# EAGLE design panocama (EAGLE 9.6.2)
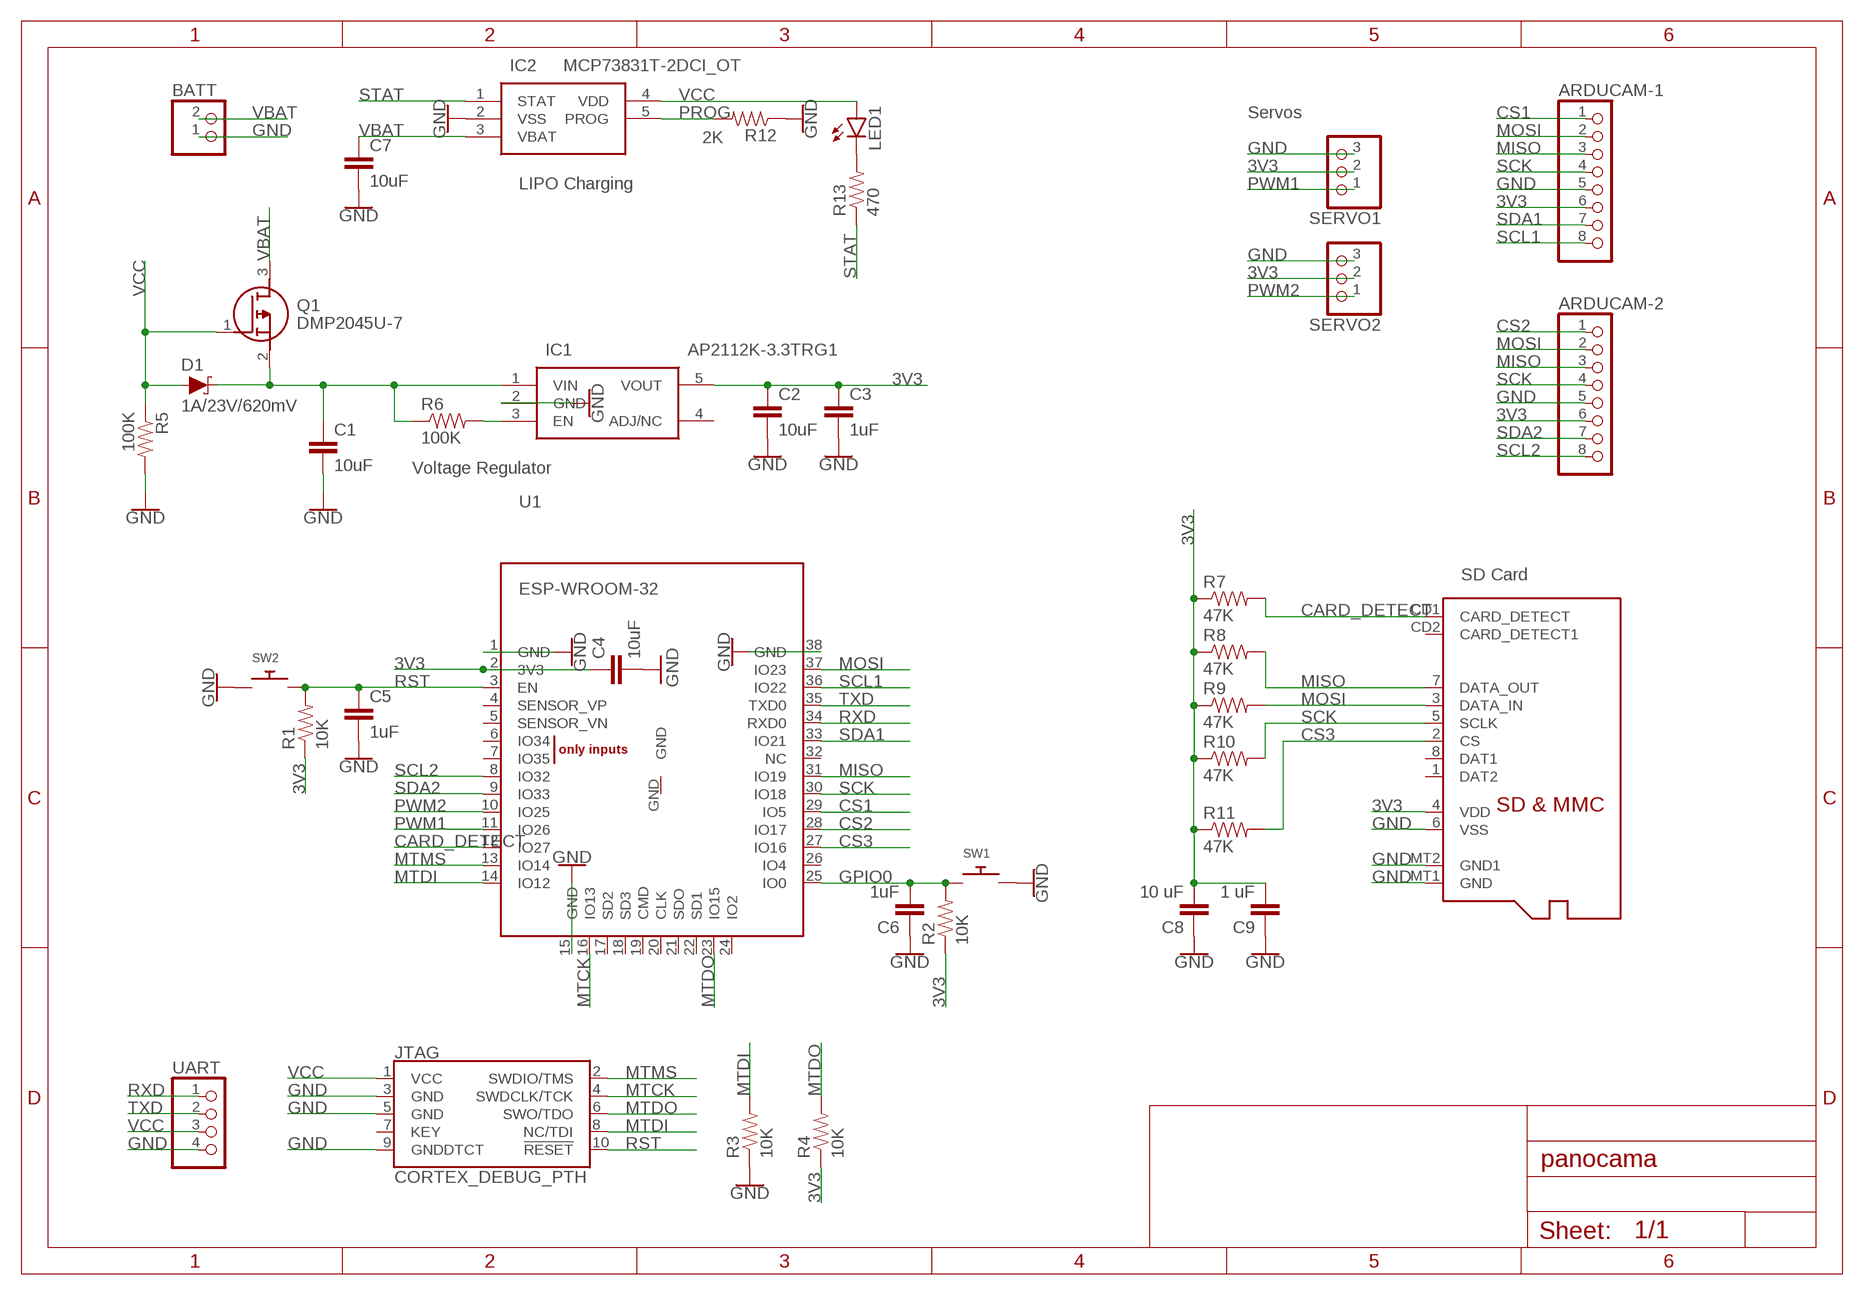
[diagram p0: schematic, sheet 1]

## Parts
ARDUCAM-1  PINHD-1X8CLEANBIG  [1X08-CLEANBIG]
ARDUCAM-2  PINHD-1X8CLEANBIG  [1X08-CLEANBIG]
BATT  JST_2PIN-SMT  [JST-PH-2-SMT]
C1  10uF  CAP  [0805]
C2  10uF  CAP  [0805]
C3  1uF  CAP  [0805]
C4  10uF  CAP  [0805]
C5  1uF  CAP  [0805]
C6  1uF  CAP  [0805]
C7  10uF  CAP  [0805]
C8  10 uF  CAP  [0805]
C9  1 uF  CAP  [0805]
D1  1A/23V/620mV  DIODE-SCHOTTKY-BAT20J  [SOD-323]
IC1  AP2112K-3.3TRG1  [SOT95P282X130-5N]
IC2  MCP73831T-2DCI_OT  [SOT95P270X145-5N]
JTAG  CORTEX_DEBUG_PTH  [2X5-PTH-1.27MM]
LED1  LED0603  [LED-0603]
Q1  DMP2045U-7  [SOT96P240X110-3N]
R1  10K  RES  [0805]
R2  10K  RES  [0805]
R3  10K  RES  [0805]
R4  10K  RES  [0805]
R5  100K  RES  [0805]
R6  100K  RES  [0805]
R7  47K  RES  [0805]
R8  47K  RES  [0805]
R9  47K  RES  [0805]
R10  47K  RES  [0805]
R11  47K  RES  [0805]
R12  2K  RES  [0805]
R13  470  RES  [0805]
SD  MICROSD  [MICROSD]
SERVO1  PINHD-1X3  [1X03]
SERVO2  PINHD-1X3  [1X03]
SW1  SWITCH_PUSHBUTTONSOFTTOUCHSMD_SJ  [PUSHBUTTON_SMD_SJ]
SW2  SWITCH_PUSHBUTTONSOFTTOUCHSMD_SJ  [PUSHBUTTON_SMD_SJ]
U1  ESP-WROOM-32  [ESP-WROOM-32]
UART  PINHD-1X4  [1X04]

## Nets
3V3: ARDUCAM-1.6 ARDUCAM-2.6 C2.1 C3.1 C4.1 C8.2 C9.2 IC1.5(VOUT) R1.1 R2.1 R4.1 R7.1 R8.1 R9.1 R10.1 R11.1 SD.4(VDD) SERVO1.2 SERVO2.2 U1.2(3V3)
CARD_DETECT: R7.2 SD.CD1(CARD_DETECT) U1.12(IO27)
CS1: ARDUCAM-1.1 U1.29(IO5)
CS2: ARDUCAM-2.1 U1.28(IO17)
CS3: R11.2 SD.2(CS) U1.27(IO16)
GND: ARDUCAM-1.5 ARDUCAM-2.5 BATT.1 C1.2 C2.2 C3.2 C4.2 C5.2 C6.1 C7.2 C8.1 C9.1 IC1.2(GND) IC2.2(VSS) JTAG.3(GND) JTAG.5(GND) JTAG.9(GNDDTCT) R3.1 R5.2 R12.1 SD.6(VSS) SD.MT1(GND) SD.MT2(GND1) SERVO1.3 SERVO2.3 SW1.P$2 SW2.P$1 U1.1(GND) U1.15(GND) U1.38(GND) UART.4
GPIO0: C6.2 R2.2 SW1.P$1 U1.25(IO0)
MISO: ARDUCAM-1.3 ARDUCAM-2.3 R8.2 SD.7(DATA_OUT) U1.31(IO19)
MOSI: ARDUCAM-1.2 ARDUCAM-2.2 R9.2 SD.3(DATA_IN) U1.37(IO23)
MTCK: JTAG.4(SWDCLK/TCK) U1.16(IO13)
MTDI: JTAG.8(NC/TDI) R3.2 U1.14(IO12)
MTDO: JTAG.6(SWO/TDO) R4.2 U1.23(IO15)
MTMS: JTAG.2(SWDIO/TMS) U1.13(IO14)
N$1: IC1.3(EN) R6.2
N$2: C1.1 D1.C IC1.1(VIN) Q1.2(S) R6.1
N$4: LED1.C R13.2
PROG: IC2.5(PROG) R12.2
PWM1: SERVO1.1 U1.11(IO26)
PWM2: SERVO2.1 U1.10(IO25)
RST: C5.1 JTAG.10(!RESET) R1.2 SW2.P$2 U1.3(EN)
RXD: U1.34(RXD0) UART.1
SCK: ARDUCAM-1.4 ARDUCAM-2.4 R10.2 SD.5(SCLK) U1.30(IO18)
SCL1: ARDUCAM-1.8 U1.36(IO22)
SCL2: ARDUCAM-2.8 U1.8(IO32)
SDA1: ARDUCAM-1.7 U1.33(IO21)
SDA2: ARDUCAM-2.7 U1.9(IO33)
STAT: IC2.1(STAT) R13.1
TXD: U1.35(TXD0) UART.2
VBAT: BATT.2 C7.1 IC2.3(VBAT) Q1.3(D)
VCC: D1.A IC2.4(VDD) JTAG.1(VCC) LED1.A Q1.1(G) R5.1 UART.3
Unconnected: IC1.4(ADJ/NC) JTAG.7(KEY) SD.1(DAT2) SD.8(DAT1) SD.CD2(CARD_DETECT1) U1.4(SENSOR_VP) U1.5(SENSOR_VN) U1.6(IO34) U1.7(IO35) U1.17(SD2) U1.18(SD3) U1.19(CMD) U1.20(CLK) U1.21(SDO) U1.22(SD1) U1.24(IO2) U1.26(IO4) U1.32(NC) U1.GND

## Notes on the sheet
- Servos
- LIPO Charging
- Voltage Regulator
- SD Card

## Library data of the parts
ARDUCAM-1 ARDUCAM-2 = adafruit:PINHD-1X8: PIN HEADER
BATT = adafruit:JST_2PIN: JST 2-Pin Connectors of various flavors SMT-RA (S2B-PH-SM4) 4UConnector #17311 SMT (B2B-PH-SM4) THM-RA (S2B-PH) THM (B2B-PH)
C1-C9 = Ilya_Teach:CAP
D1 = SparkFun-DiscreteSemi:DIODE-SCHOTTKY: Schottky diode A Schottky diode is a semiconductor diode which has a low forward voltage drop and a very fast switching action.; PROD_ID: DIO-11623
IC1 = AP2112K-3.3TRG1:AP2112K-3.3TRG1: 600mA 3.3V LDO Regulator Enable SOT23-5 DiodesZetex AP2112K-3.3TRG1, LDO Voltage Regulator, 3.3 V +/-1.5%, 2.5 6 Vin, 5-Pin SOT-23 Source: Datasheet <http://uk.rs-online.com/web/p/products/8283509>; ARROW_PART_NUMBER: AP2112K-3.3TRG1; ARROW_PRICE-STOCK: https://www.arrow.com/en/products/ap2112k-3.3trg1/diodes-incorporated; DESCRIPTION: 600mA 3.3V LDO Regulator Enable SOT23-5 DiodesZetex AP2112K-3.3TRG1, LDO Voltage Regulator, 3.3 V +/-1.5%, 2.5 6 Vin, 5-Pin SOT-23; HEIGHT: 1.3mm; MANUFACTURER_NAME: Diodes Inc.; MANUFACTURER_PART_NUMBER: AP2112K-3.3TRG1; MOUSER_PART_NUMBER: 621-AP2112K-3.3TRG1; MOUSER_PRICE-STOCK: https://www.mouser.co.uk/ProductDetail/Diodes-Incorporated/AP2112K-33TRG1?qs=x6A8l6qLYDDPYHosCdzh%2FA%3D%3D
IC2 = MCP73831T-2DCI_OT:MCP73831T-2DCI_OT: Charge Controller Li-Ion/Li-Pol Source: Datasheet <http://ww1.microchip.com/downloads/en/DeviceDoc/20001984g.pdf>; ARROW_PART_NUMBER: MCP73831T-2DCI/OT; ARROW_PRICE-STOCK: https://www.arrow.com/en/products/mcp73831t-2dciot/microchip-technology; DESCRIPTION: Charge Controller Li-Ion/Li-Pol; HEIGHT: 1.45mm; MANUFACTURER_NAME: Microchip; MANUFACTURER_PART_NUMBER: MCP73831T-2DCI/OT; MOUSER_PART_NUMBER: 579-MCP73831T-2DCIOT; MOUSER_PRICE-STOCK: https://www.mouser.co.uk/ProductDetail/Microchip-Technology/MCP73831T-2DCI-OT?qs=yUQqVecv4qu38ml9qkvsJw%3D%3D
JTAG = SparkFun-Connectors:CORTEX_DEBUG: Cortex Debug Connector - 10 pin Supports JTAG debug, Serial Wire debug, and Serial Wire Viewer. PTH and SMD connector options available. General Connector Information <http://infocenter.arm.com/help/topic/com.arm.doc.faqs/attached/13634/cortex_debug_connectors.pdf> Products: PTH Connector <http://www.digikey.com/product-detail/en/cnc-tech/3220-10-0100-00/1175-1627-ND/3883661> -via Digi-Key SparkFun PSoc <https://www.sparkfun.com/products/13229> SparkFun T <https://www.sparkfun.com/products/13810>
LED1 = Ilya_Teach:LED: LEDs Standard schematic elements and footprints for 5mm, 3mm, 1206, and 0603 sized LEDs. 5mm - Spark Fun Electronics SKU : COM-00529 (and others)
Q1 = DMP2045U-7:DMP2045U-7: DMP2045U-7 P-Channel MOSFET, 3.5 (State) A, 4.3 (Steady) A, 20 V, 3-Pin SOT-23 Diodes Inc Source: Datasheet <https://www.diodes.com/assets/Datasheets/DMP2045U.pdf>; ARROW_PART_NUMBER: DMP2045U-7; ARROW_PRICE-STOCK: https://www.arrow.com/en/products/dmp2045u-7/diodes-incorporated; DESCRIPTION: DMP2045U-7 P-Channel MOSFET, 3.5 (State) A, 4.3 (Steady) A, 20 V, 3-Pin SOT-23 Diodes Inc; HEIGHT: 1.1mm; MANUFACTURER_NAME: Diodes Inc.; MANUFACTURER_PART_NUMBER: DMP2045U-7; MOUSER_PART_NUMBER: 621-DMP2045U-7; MOUSER_PRICE-STOCK: https://www.mouser.co.uk/ProductDetail/Diodes-Incorporated/DMP2045U-7?qs=rrS6PyfT74erdUwo5CgHTg%3D%3D
R1-R13 = Ilya_Teach:RES
SD = adafruit:MICROSD: Micro-SD / Transflash card holder with SPI pinout For the 3M # 2908-05WB-MG and/or 4UCON #19656 push-push type
SERVO1 SERVO2 = adafruit:PINHD-1X3: PIN HEADER
SW1 SW2 = adafruit:SWITCH_PUSHBUTTON: Buttons SOFTTOUCHSMD_SJ - Soft touch temporary push button (Super Junk Akihabara) Compatible with SKPMANE010 [Mouser: 688-SKPMAN] C&K_KSS = Digikey: KSS221GLFS
U1 = esp32:ESP-WROOM-32
UART = pinhead:PINHD-1X4: PIN HEADER

## Board
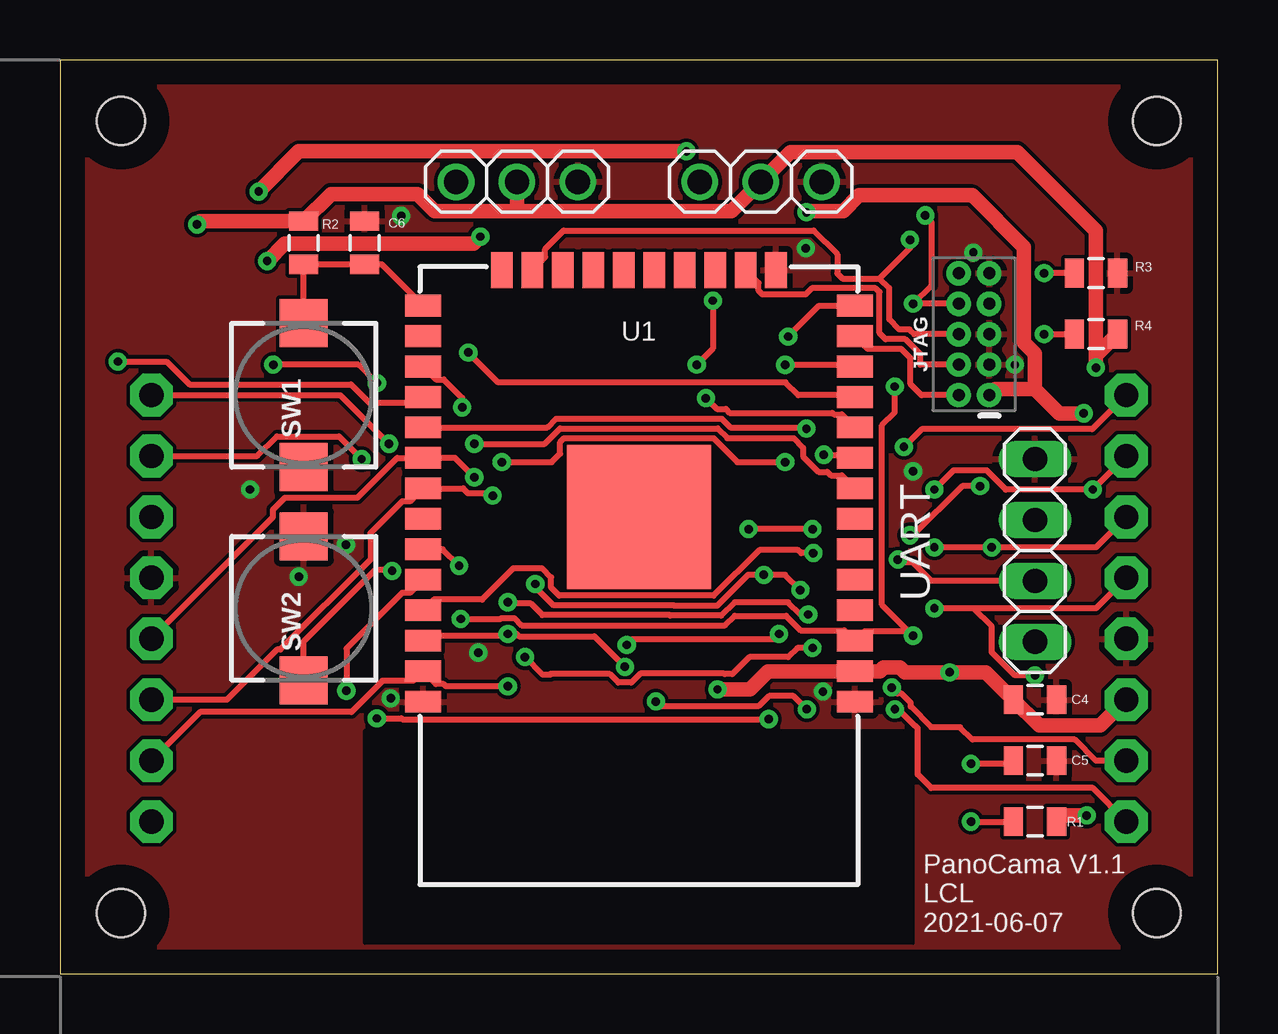
[diagram p1: board, top side]
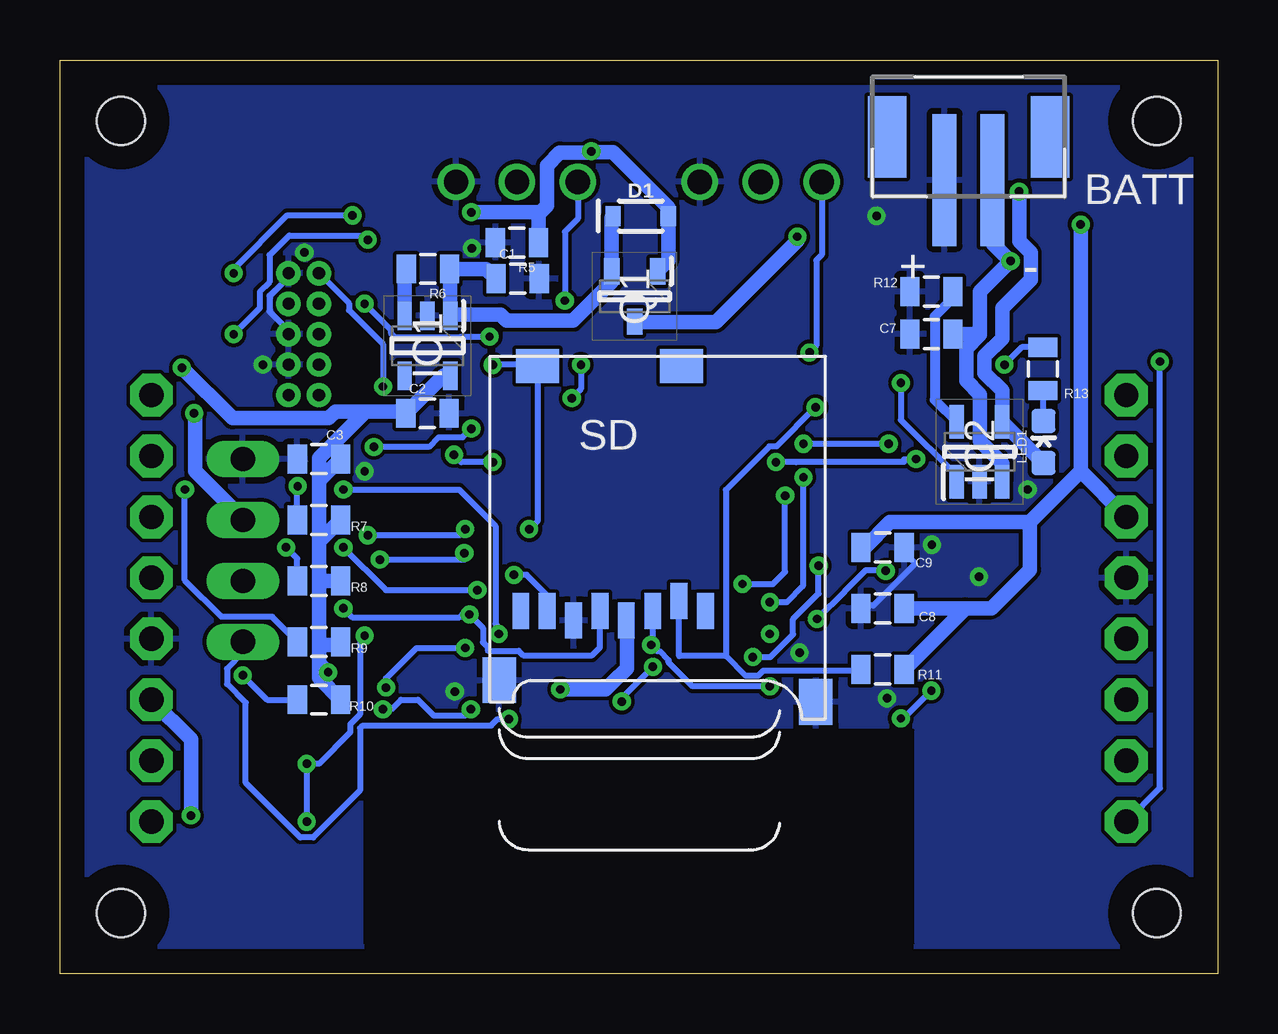
[diagram p2: board, bottom side, seen from below]

Size 48.26 x 38.1 mm. Coordinates in mm from the lower left corner, seen from the top.
Outline: 0,0 48.26,0 48.26,38.1 0,38.1 0,0
Copper layers (1*16): Top 0.035mm / dielectric 1.5mm / Bottom 0.035mm
Design rules "default": minimum track width 6mil, minimum drill 0.35mm, track to track 6mil, track to pad 6mil, pad to pad 6mil, via to via 6mil, smd to smd 6mil, copper to edge 40mil, drill to drill 6mil, minimum pad ring 10mil, minimum via ring 8mil, stop-mask expansion 4mil, vias tented up to drill 0mil, thermal gap 10mil
Holes 2 mm at 2.54,2.54 45.72,2.54 45.72,35.56 2.54,35.56

### Footprints (pad centres in the part's own frame; a part is rotated, then mirrored left to right if it is on the bottom)
1X08-CLEANBIG = drill 1.016 pad 1.778 octagon: 1 -8.89,0; 2 -6.35,0; 3 -3.81,0; 4 -1.27,0; 5 1.27,0; 6 3.81,0; 7 6.35,0; 8 8.89,0
JST-PH-2-SMT = smd 1 x 5.5: 1 -1,-1.8; 2 1,-1.8 | smd 1.6 x 3.4: NC1 -3.4,0; NC2 3.4,0
0805 = smd 0.8 x 1.2: 1 -0.9,0; 2 0.9,0
SOD-323 = smd 0.63 x 0.83: A 1.15,0; C -1.15,0
SOT95P282X130-5N = smd 1.2 x 0.6: 1 -1.25,0.95; 2 -1.25,0; 3 -1.25,-0.95; 4 1.25,-0.95; 5 1.25,0.95
SOT95P270X145-5N = smd 1.4 x 0.6: 1 -1.25,0.95; 2 -1.25,0; 3 -1.25,-0.95; 4 1.25,-0.95; 5 1.25,0.95
2X5-PTH-1.27MM = drill 0.508 pad 1: 1 -2.54,-0.635; 2 -2.54,0.635; 3 -1.27,-0.635; 4 -1.27,0.635; 5 0,-0.635; 6 0,0.635; 7 1.27,-0.635; 8 1.27,0.635; 9 2.54,-0.635; 10 2.54,0.635
LED-0603 = smd 1 x 1: A 0,-0.877; C 0,0.877
SOT96P240X110-3N = smd 1.1 x 0.65: 1 -1.05,0.96; 2 -1.05,-0.96; 3 1.05,0
MICROSD = smd 0.7 x 1.5: 1 9,-10.64; 2 7.9,-10.24; 3 6.8,-10.64; 4 5.7,-11.04; 5 4.6,-10.64; 6 3.5,-11.04; 7 2.4,-10.64; 8 1.3,-10.64 | smd 1.8 x 1.4: CD1 2,-0.44; CD2 8,-0.44 | smd 1.4 x 1.9: MT1 0.4,-13.54; MT2 13.6,-14.44
1X03 = drill 1.016: 1 -2.54,0; 2 0,0; 3 2.54,0
PUSHBUTTON_SMD_SJ = smd 2 x 2: P$1 3,0; P$2 -3,0
ESP-WROOM-32 = smd 0.9 x 1.5: 1 7.7,9; 2 6.43,9; 3 5.16,9; 4 3.89,9; 5 2.62,9; 6 1.35,9; 7 0.08,9; 8 -1.19,9; 9 -2.46,9; 10 -3.73,9; 11 -5,9; 12 -6.27,9; 13 -7.54,9; 14 -8.81,9; 25 -8.81,-9; 26 -7.54,-9; 27 -6.27,-9; 28 -5,-9; 29 -3.73,-9; 30 -2.46,-9; 31 -1.19,-9; 32 0.08,-9; 33 1.35,-9; 34 2.62,-9; 35 3.89,-9; 36 5.16,-9; 37 6.43,-9; 38 7.7,-9 | smd 1.5 x 0.9: 15 -10.3,5.715; 16 -10.3,4.445; 17 -10.3,3.175; 18 -10.3,1.905; 19 -10.3,0.635; 20 -10.3,-0.635; 21 -10.3,-1.905; 22 -10.3,-3.175; 23 -10.3,-4.445; 24 -10.3,-5.715 | smd 6 x 6: GND 0,0
1X04 = drill 1.016 long: 1 -3.81,0; 2 -1.27,0; 3 1.27,0; 4 3.81,0

### Placement (x,y rotation side)
ARDUCAM-1  44.45,15.24 270 top
ARDUCAM-2  3.81,15.24 90 top
BATT  10.39,34.9 0 bottom
C1  29.18,28.98 0 bottom
C2  32.94,23.37 0 bottom
C3  37.47,21.46 180 bottom
C4  40.64,11.43 0 top
C5  40.64,8.89 0 top
C6  12.7,30.48 270 top
C7  11.94,26.67 180 bottom
C8  13.97,15.24 0 bottom
C9  13.97,17.78 180 bottom
D1  24.05,31.6 0 bottom
IC1  32.94,26.19 270 bottom
IC2  9.93,21.77 90 bottom
JTAG  38.1,26.67 90 top
LED1  7.26,22.17 0 bottom
Q1  24.31,28.24 270 bottom
R1  40.64,6.35 180 top
R2  10.16,30.48 270 top
R3  43.18,29.21 180 top
R4  43.18,26.67 180 top
R5  29.21,30.48 180 bottom
R6  32.92,29.39 180 bottom
R7  37.47,18.92 180 bottom
R8  37.47,16.38 180 bottom
R9  37.47,13.84 180 bottom
R10  37.47,11.43 180 bottom
R11  13.97,12.7 180 bottom
R12  11.94,28.45 0 bottom
R13  7.29,25.22 270 bottom
SD  30.35,25.78 0 bottom
SERVO1  19.05,33.02 0 top
SERVO2  29.21,33.02 0 top
SW1  10.16,24.13 90 top
SW2  10.16,15.24 90 top
U1  24.13,19.05 270 top
UART  40.64,17.65 90 top

### Tracks (layer width: path | path; a pad name or v marks a point on that pad's centre or on a via)
3V3  (via drill 0.35)
  Top 0.61: ARDUCAM-1.6 43.37,10.35 40.82,10.35 C4.1 38.6,12.57 v37.08,12.57 35.22,12.57 35.02,12.77 34.33,12.77 34.17,12.62 U1.2 29.51,12.62 28.75,11.86 v27.41,11.86 | v42.8,6.6 41.79,6.6 R1.1 | v43.18,25.27 43.18,25.77 | 43.18,25.77 R4.1 | 43.18,25.77 43.18,30.99 39.9,34.27 30.45,34.27 SERVO2.2 27.99,31.8 18.9,31.8 | 18.9,31.8 15.62,31.8 14.9,32.52 11.3,32.52 R2.1 5.85,31.38 v5.71,31.24 | 18.9,31.8 19.05,31.95 SERVO1.2
  Bottom 0.61: ARDUCAM-1.6 42.8,9.78 v42.8,6.6 | R7.1 37.47,18.02 | 37.47,18.02 37.47,16.51 | 37.47,16.51 37.34,16.38 R8.1 | 37.47,16.51 37.47,13.72 | 37.47,13.72 36.69,13.72 R9.1 | C3.1 37.47,20.56 | 37.47,20.56 37.47,18.02 | 35.52,23.45 37.47,21.5 37.47,20.56 | 37.47,13.72 37.47,12.95 | 37.47,12.95 v37.08,12.57 | 35.52,23.45 36.78,23.45 37.06,23.16 41.07,23.16 v43.18,25.27 | v5.71,31.24 5.71,20.95 | 5.71,20.95 ARDUCAM-2.6 | C9.2 14.72,17.78 13.66,18.84 7.83,18.84 | 7.83,18.84 5.71,20.95 | R11.1 10.53,15.24 | 7.83,18.84 7.83,16.85 9.44,15.24 10.53,15.24 | C8.2 10.53,15.24 | 37.47,12.95 37.47,12.33 R10.1 | SD.4 24.63,14.72 24.63,12.74 25.18,12.19 25.19,12.19 25.52,11.86 v27.41,11.86 | 35.52,23.45 33.93,23.45 C2.1 32.27,24.94 IC1.5
CARD_DETECT  (via drill 0.35)
  Top 0.254: v31.37,18.54 v28.7,18.54 | v38.35,20.33 37.6,20.33 35.56,18.29 v35.43,18.29 | v30.23,25.39 33.06,25.39 U1.12
  Bottom 0.254: R7.2 38.37,20.32 v38.35,20.33 | v35.43,18.29 31.62,18.29 v31.37,18.54 | v30.23,25.39 28.4,25.39 SD.CD1 28.35,18.89 v28.7,18.54
CS1  (via drill 0.35)
  Top 0.254: v31.11,22.73 31.07,22.78 27.95,22.78 27.58,23.14 20.68,23.14 20.32,22.78 U1.29 | v35.18,21.97 35.92,22.71 43.03,22.71 ARDUCAM-1.1
  Bottom 0.254: v31.11,22.73 31.47,22.38 32.48,22.38 32.88,21.97 v35.18,21.97
CS2  (via drill 0.35)
  Top 0.254: U1.28 14.88,23.8 12.91,23.8 12.13,24.57 5.4,24.57 4.45,25.53 v2.41,25.53
  Bottom 0.254: ARDUCAM-2.1 2.41,7.75 v2.41,25.53
CS3  (via drill 0.35)
  Top 0.254: U1.27 15.67,24.78 16,24.78 16.76,24.01 v16.76,23.62
  Bottom 0.254: SD.2 22.45,13.25 20.51,13.25 | v16.76,23.62 18.39,21.99 18.69,21.99 20.51,20.18 20.51,13.25 | R11.2 14.92,12.65 18.94,12.65 19.16,12.42 19.68,12.42 20.51,13.25
GND  (via drill 0.35)
  Bottom 0.254: JTAG.9 38.73,29.05 39.52,28.27 39.52,27.61 38.73,26.83 JTAG.5 | C8.1 14.75,15.36 14.36,15.36 12.61,17.11 13.07,17.57 C9.1
  other vias: 35.56,20.95 39.8,25.4 13.79,11.49 9.95,16.56 31.8,11.77 11.92,17.89 17.43,13.39 7.92,20.19 14.22,31.6 31.09,30.25 38.07,30.07
  pour Bottom: 0,37.85 0,-0.13 48.64,-0.25 48.64,37.59 48.39,37.85
  pour Top: 0,37.85 0,0.13 0.13,0 48.13,0 48.26,-0.13 48.26,37.59 48.13,37.72 0.13,37.72
GPIO0
  Top 0.254: SW1.P$1 R2.2 C6.2 13.41,29.58 U1.25
MISO  (via drill 0.35)
  Top 0.254: v30.86,16 30.23,16.64 v29.34,16.64 28.69,16.64 27.39,15.34 25.61,15.34 25.59,15.36 20.58,15.36 19.81,16.13 v19.81,16.26 | ARDUCAM-1.3 43.18,17.78 v38.84,17.78 v36.45,17.78 | v18.03,19.94 17.93,20.04 17,20.04 16.8,20.24 U1.31 14.59,19.7 14.26,19.7 12.94,18.37 12.94,17.27 9.18,13.52 9.04,13.52 6.96,11.43 ARDUCAM-2.3
  Bottom 0.254: v29.34,16.64 28.8,16.64 27.95,15.79 SD.7 | v18.03,19.94 18.03,16.76 18.54,16.26 v19.81,16.26 | v36.45,17.78 34.67,16 v30.86,16 | R8.2 38.37,17.31 v38.84,17.78
MOSI  (via drill 0.35)
  Top 0.254: ARDUCAM-1.2 v43.05,20.19 39.42,20.19 38.63,20.99 37.25,20.99 v36.45,20.19 | ARDUCAM-2.2 5.84,10.92 12.15,10.92 13.44,12.21 14.72,12.21 U1.37 15.67,12.08 16,12.08 16.09,11.99 v18.67,11.99 | v29.97,14.17 29.95,14.15 29.95,14.1 29.79,13.95 25.26,13.95 23.85,13.95 v23.62,13.72
  Bottom 0.254: SD.3 23.55,13.79 v23.62,13.72 23.36,13.46 23.27,13.46 22.89,13.07 22.89,12.98 21.89,11.99 v18.67,11.99 | v29.97,14.17 29.97,14.45 30.11,14.59 30.11,18.68 31.62,20.19 v36.45,20.19 | R9.2 39.41,14.88 41.53,14.88 43.05,16.41 v43.05,20.19
MTCK
  Top 0.254: U1.16 29.12,28.81 29.12,28.48 29.28,28.32 31.07,28.32 31.34,28.59 34,28.59 34.16,28.43 34.16,26.71 34.41,26.46 35.24,26.46 35.86,25.84 35.86,25.4 JTAG.4
MTDI  (via drill 0.35)
  Top 0.254: R3.2 v41.02,29.21 | v36.07,31.62 36.32,31.37 36.32,28.7 v35.56,27.94 JTAG.8 | v30.35,26.57 31.64,27.86 U1.14
  Bottom 0.254: v41.02,29.21 41.02,29.39 38.79,31.62 v36.07,31.62 | v35.56,27.94 34.47,26.85 34.47,26.72 34.31,26.56 31.58,26.56 31.57,26.57 v30.35,26.57
MTDO  (via drill 0.35)
  Top 0.254: 34.16,29 34.57,28.59 34.57,27.28 34.98,26.87 35.41,26.87 35.61,26.67 JTAG.6 | 34.16,29 32.61,29 32.4,29.2 32.4,30 31.41,30.99 21,30.99 20.23,30.22 20.23,29.89 U1.23 | 34.16,29 35.43,30.27 v35.43,30.61 | v41.02,26.67 R4.2
  Bottom 0.254: v35.43,30.61 35.61,30.79 38.71,30.79 39.52,29.97 39.52,28.84 39.93,28.43 39.93,27.76 v41.02,26.67
MTMS
  Top 0.254: U1.13 33.67,26.05 34.52,26.05 34.53,26.06 35.07,26.06 35.46,25.67 35.46,24.59 35.91,24.13 JTAG.2
N$1
  Bottom 0.61: R6.2 33.89,29.31 IC1.3
N$2
  Bottom 0.61: D1.C 25.27,31.53 Q1.2 25.27,28.84 26.87,27.23 29.64,27.23 29.9,27.49 31.94,27.49 IC1.1 31.99,29.36 R6.1 30.49,29.39 C1.1
N$4
  Bottom 0.254: LED1.C 7.26,24.3 R13.2
PROG
  Bottom 0.406: R12.2 11.04,28.17 11.79,27.42 11.79,23.93 IC2.5
PWM1  (via drill 0.35)
  Top 0.254: v17.02,25.91 18.27,24.66 30.24,24.66 30.77,24.13 33.05,24.13 U1.11
  Bottom 0.254: SERVO1.1 16.51,29.98 16.73,29.76 16.73,26.2 v17.02,25.91
PWM2  (via drill 0.35)
  Top 0.254: v26.92,24 27.38,23.55 27.75,23.55 27.91,23.39 32.19,23.39 32.26,23.32 32.59,23.32 U1.10 | v27.22,28.07 27.22,26.07 v26.54,25.4
  Bottom 0.254: SERVO2.1 26.67,31.48 27.22,30.94 v27.22,28.07 | v26.54,25.4 26.54,24.38 v26.92,24
RST  (via drill 0.35)
  Top 0.254: v37.97,8.76 39.61,8.76 C5.1 | v37.97,6.35 R1.2 | v34.8,24.49 34.8,23.41 34.27,22.88 34.27,15.39 v35.56,14.1 35.43,14.22 35.31,14.22 35.26,14.27 33.51,14.27 U1.3 32.69,14.33 30.87,14.33 30.26,14.93 28.13,14.93 27.73,14.53 19.24,14.53 18.94,14.83 18.4,14.83 18.36,14.8 v16.7,14.8 | SW2.P$2 10.16,13.87 13.14,16.85 13.8,16.85 v13.85,16.8
  Bottom 0.254: v37.97,6.35 v37.97,8.76 37.47,8.76 36.16,10.07 36.16,10.41 35.75,10.81 35.75,13.91 v35.56,14.1 | v16.7,14.8 15.55,15.95 15.55,15.96 14.67,16.83 13.87,16.83 v13.85,16.8 | JTAG.10 36.22,27.96 36.22,27.67 34.8,26.25 v34.8,24.49
RXD  (via drill 0.35)
  Top 0.254: U1.34 14.59,15.89 14.26,15.89 11.94,13.56 v11.94,11.81 | v13.21,10.65 14.23,10.65 14.26,10.62 v29.54,10.62
  Bottom 0.254: v11.94,11.81 13.1,10.65 v13.21,10.65 | UART.1 40.64,13.38 41.3,12.72 41.3,12.09 40.51,11.3 40.51,7.96 38.24,5.69 37.7,5.69 35.75,7.64 35.75,10.24 35.64,10.35 32.35,10.35 30.29,10.35 30.01,10.63 v29.55,10.63 v29.54,10.62
SCK  (via drill 0.35)
  Top 0.254: ARDUCAM-1.4 43.18,15.24 38.1,15.24 | 38.1,15.24 v36.45,15.24 | v31.19,14.99 30.86,14.99 30.35,15.49 28.12,15.49 27.56,14.94 25.44,14.94 25.42,14.96 20.11,14.96 19.63,15.44 18.72,15.44 v18.67,15.49 | v17.27,20.7 16.46,21.51 U1.30 14.06,21.51 12.4,19.85 9.38,19.85 8.88,19.36 8.88,19.04 ARDUCAM-2.4 | v40.64,12.45 39.8,12.45 38.84,13.41 38.84,14.5 38.1,15.24
  Bottom 0.254: v36.45,15.24 36.08,14.87 31.6,14.87 31.49,14.99 v31.19,14.99 30.63,14.43 30.63,13.82 30.43,13.62 30.43,13.49 30.41,13.47 29.14,13.47 28.95,13.28 26.07,13.28 25.75,13.61 SD.5 | v18.67,15.49 17.96,15.49 17.3,16.16 17.3,20.68 v17.27,20.7 | v40.64,12.45 39.62,11.43 R10.2
SCL1  (via drill 0.35)
  Top 0.254: ARDUCAM-1.8 43.05,7.75 36.32,7.75 35.75,8.32 35.75,10.24 35.64,10.35 35.62,10.35 34.95,11.03 v34.8,11.03 | v31.13,11.03 30.58,11.59 29.55,11.59 29.14,11.18 25.02,11.18 v24.84,11.35 | U1.36 15.33,14.09 18.58,14.09 v18.67,14.17 19.02,14.17 19.13,14.07 22.28,14.07 v23.55,12.8
  Bottom 0.254: v34.8,11.03 34.45,11.03 34.05,11.43 33.34,11.43 32.68,10.77 31.39,10.77 v31.13,11.03 | v23.55,12.8 24.84,11.51 v24.84,11.35
SCL2  (via drill 0.35)
  Top 0.254: ARDUCAM-2.8 11.68,24.13 v13.72,22.1 | U1.8 32.59,20.78 32.14,20.78 31.99,20.93 31.62,20.93 30.98,21.57 30.98,21.94 30.59,22.33 27.82,22.33 27.41,22.74 20.85,22.74 20.21,22.1 v17.27,22.1
  Bottom 0.254: v13.72,22.1 v17.27,22.1
SDA1  (via drill 0.35)
  Top 0.254: ARDUCAM-1.7 43.18,8.89 42.3,9.77 38.03,9.77 37.52,10.29 36.32,10.29 35.46,11.15 35.46,11.3 35.07,11.69 34.92,11.69 v34.67,11.94 | v19.38,13.21 20.12,12.47 20.45,12.47 20.42,12.5 22.92,12.5 23.27,12.14 23.82,12.14 24.19,12.52 27.68,12.52 27.7,12.5 28.03,12.5 28.74,13.2 30.35,13.2 30.73,13.59 v31.37,13.59 | v16.64,17.02 15.96,17.7 U1.33
  Bottom 0.254: v34.67,11.94 34.67,12.32 33.4,13.59 v31.37,13.59 | v16.64,17.02 16.64,15.86 17.7,14.79 17.7,14.16 18.65,13.21 v19.38,13.21
SDA2  (via drill 0.35)
  Top 0.254: ARDUCAM-2.7 8.22,21.59 9.04,22.41 11.63,22.41 v12.57,21.46 | v18.41,21.34 20.5,21.34 20.85,21.69 20.85,22.17 21.01,22.33 27.25,22.33 28.24,21.34 v30.23,21.34 | v31.84,21.64 33,21.64 U1.9
  Bottom 0.254: v12.57,21.46 13.08,21.46 13.08,21.36 17.54,21.36 17.57,21.34 v18.41,21.34 | v30.23,21.34 31.53,21.34 v31.84,21.64
STAT  (via drill 0.35)
  Top 0.254: v13.21,24.64 12.45,25.4 v8.89,25.4
  Bottom 0.254: R13.1 8.17,26.12 v8.89,25.4 | v13.21,24.64 13.21,23.1 10.88,20.77 IC2.1
TXD  (via drill 0.35)
  Top 0.254: UART.2 36.32,16.38 35.56,17.14 35.05,17.14 v34.92,17.27 | v31.4,17.55 30.9,17.55 30.77,17.67 29.15,17.67 27.25,15.77 20.8,15.77 20.47,16.11 20.47,16.53 20.08,16.91 18.91,16.91 17.59,15.6 15.57,15.6 U1.35
  Bottom 0.254: v34.92,17.27 31.4,17.27 v31.4,17.55
VBAT  (via drill 0.35)
  Top 0.61: v8.64,29.72 v8.65,29.72 9.37,30.44 17.23,30.44 v17.53,30.73
  Bottom 0.61: Q1.3 24.31,27.18 20.91,27.18 17.53,30.56 v17.53,30.73 | IC2.3 8.98,21.28 9.91,22.2 9.91,24.16 10.49,24.74 10.49,26.06 9.91,26.64 9.91,26.67 | 9.91,26.67 9.91,28.45 v8.64,29.72 9.39,30.47 BATT.2 | C7.1 9.91,26.67
VCC  (via drill 0.35)
  Top 0.61: JTAG.1 38.99,24.38 40.64,24.38 | v42.67,23.37 41.66,23.37 40.64,24.38 | 40.64,24.38 40.64,25.87 40.19,26.32 40.19,30.3 38.03,32.46 33.31,32.46 32.65,31.8 31.11,31.8 v31.11,31.75 | v8.28,32.61 9.96,34.29 v26.11,34.29
  Bottom 0.61: 28.31,31.67 27.96,32.02 27.96,33.7 27.43,34.24 26.16,34.24 v26.11,34.29 26.11,34.27 25.21,34.27 22.9,31.95 D1.A 22.9,29.74 23.22,29.43 23.22,29.42 Q1.1 | UART.3 40.64,18.98 42.62,20.96 42.62,23.32 v42.67,23.37 | v31.11,31.75 28.39,31.75 28.31,31.67 | 28.31,31.67 R5.1 | LED1.A IC2.4 8.98,24.31 9.72,25.05 9.72,25.75 8.98,26.49 8.98,27.76 7.8,28.94 7.8,30.06 8.28,30.54 v8.28,32.61

### Text on the board
tPlace: PanoCama V1.1 / LCL / 2021-06-07
tDocu: PWM | 3V3 | PWM | 3V3 | GND | GND | CS | SCL | GPIO0 | SDA | GND | MOSI | VCC | 3V3 | MISO | TXD | GND | EN | SCK | SCK | RXD | GND | MISO | 3V3 | MOSI | SDA | CS | SCL